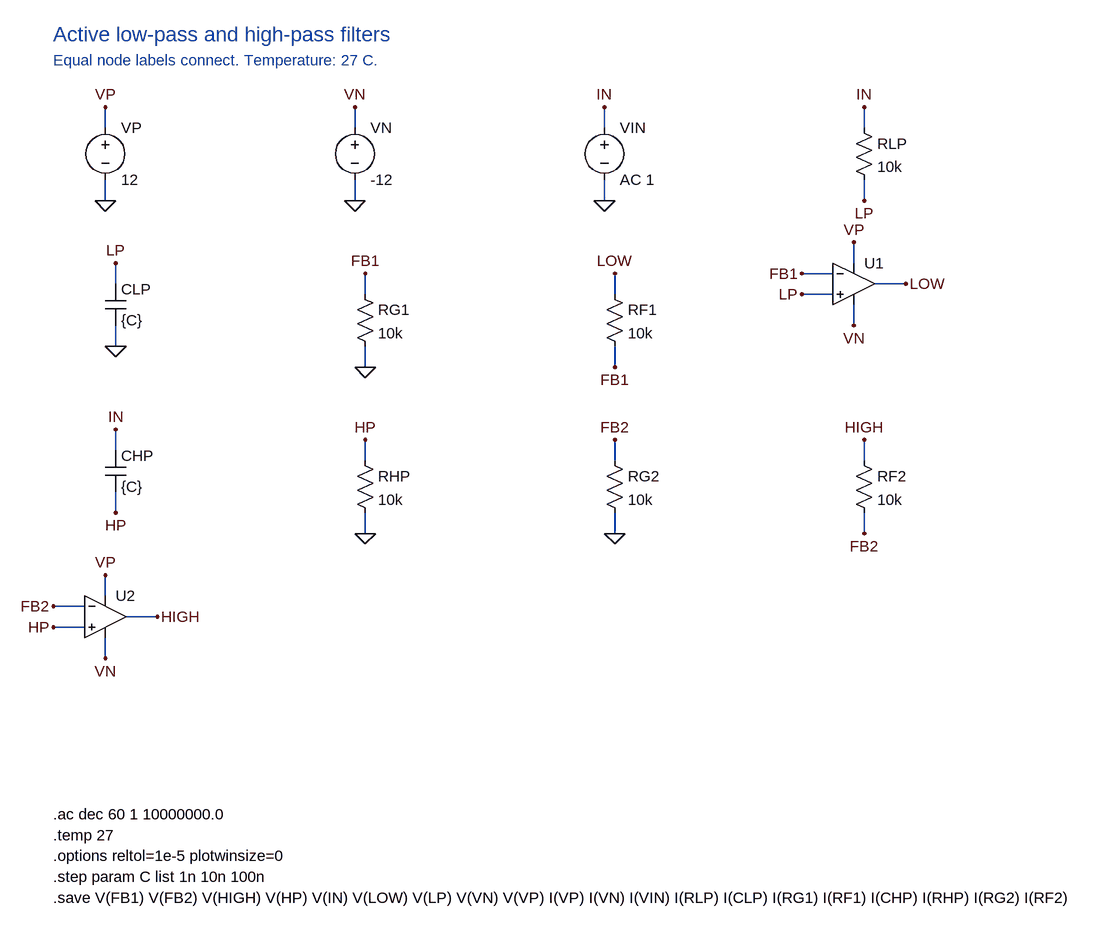
[diagram p0: schematic active-filter-pair.asc]
active-filter-pair.asc, the LTspice schematic file:
Version 4
SHEET 1 1740 1512
WIRE 144 176 144 144
WIRE 144 256 144 288
WIRE 528 176 528 144
WIRE 528 256 528 288
WIRE 912 176 912 144
WIRE 912 256 912 288
WIRE 1312 176 1312 144
WIRE 1312 256 1312 288
WIRE 160 416 160 384
WIRE 160 480 160 512
WIRE 544 432 544 400
WIRE 544 512 544 544
WIRE 928 432 928 400
WIRE 928 512 928 544
WIRE 1264 432 1216 432
WIRE 1264 400 1216 400
WIRE 1296 384 1296 352
WIRE 1296 448 1296 480
WIRE 1328 416 1376 416
WIRE 160 672 160 640
WIRE 160 736 160 768
WIRE 544 688 544 656
WIRE 544 768 544 800
WIRE 928 688 928 656
WIRE 928 768 928 800
WIRE 1312 688 1312 656
WIRE 1312 768 1312 800
WIRE 112 944 64 944
WIRE 112 912 64 912
WIRE 144 896 144 864
WIRE 144 960 144 992
WIRE 176 928 224 928
FLAG 144 144 VP
FLAG 144 288 0
FLAG 528 144 VN
FLAG 528 288 0
FLAG 912 144 IN
FLAG 912 288 0
FLAG 1312 144 IN
FLAG 1312 288 LP
FLAG 160 384 LP
FLAG 160 512 0
FLAG 544 400 FB1
FLAG 544 544 0
FLAG 928 400 LOW
FLAG 928 544 FB1
FLAG 1216 432 LP
FLAG 1216 400 FB1
FLAG 1296 352 VP
FLAG 1296 480 VN
FLAG 1376 416 LOW
FLAG 160 640 IN
FLAG 160 768 HP
FLAG 544 656 HP
FLAG 544 800 0
FLAG 928 656 FB2
FLAG 928 800 0
FLAG 1312 656 HIGH
FLAG 1312 800 FB2
FLAG 64 944 HP
FLAG 64 912 FB2
FLAG 144 864 VP
FLAG 144 992 VN
FLAG 224 928 HIGH
SYMBOL voltage 144 160 R0
SYMATTR InstName VP
SYMATTR Value 12
SYMBOL voltage 528 160 R0
SYMATTR InstName VN
SYMATTR Value -12
SYMBOL voltage 912 160 R0
SYMATTR InstName VIN
SYMATTR Value AC 1
SYMBOL res 1296 160 R0
SYMATTR InstName RLP
SYMATTR Value 10k
SYMBOL cap 144 416 R0
SYMATTR InstName CLP
SYMATTR Value {C}
SYMBOL res 528 416 R0
SYMATTR InstName RG1
SYMATTR Value 10k
SYMBOL res 912 416 R0
SYMATTR InstName RF1
SYMATTR Value 10k
SYMBOL OpAmps/UniversalOpamp2 1296 416 R0
SYMATTR InstName U1
SYMATTR SpiceModel level2
SYMATTR Value2 Avol=1Meg GBW=10Meg Slew=10Meg
SYMATTR SpiceLine Ilimit=100m Rail=0.5 Vos=0
SYMATTR SpiceLine2 En=0 Enk=0 In=0 Ink=0 Rin=1G
SYMBOL cap 144 672 R0
SYMATTR InstName CHP
SYMATTR Value {C}
SYMBOL res 528 672 R0
SYMATTR InstName RHP
SYMATTR Value 10k
SYMBOL res 912 672 R0
SYMATTR InstName RG2
SYMATTR Value 10k
SYMBOL res 1296 672 R0
SYMATTR InstName RF2
SYMATTR Value 10k
SYMBOL OpAmps/UniversalOpamp2 144 928 R0
SYMATTR InstName U2
SYMATTR SpiceModel level2
SYMATTR Value2 Avol=1Meg GBW=10Meg Slew=10Meg
SYMATTR SpiceLine Ilimit=100m Rail=0.5 Vos=0
SYMATTR SpiceLine2 En=0 Enk=0 In=0 Ink=0 Rin=1G
TEXT 64 32 Left 3 ;Active low-pass and high-pass filters
TEXT 64 72 Left 2 ;Equal node labels connect. Temperature: 27 C.
TEXT 64 1232 Left 2 !.ac dec 60 1 10000000.0
TEXT 64 1264 Left 2 !.temp 27
TEXT 64 1296 Left 2 !.options reltol=1e-5 plotwinsize=0
TEXT 64 1328 Left 2 !.step param C list 1n 10n 100n
TEXT 64 1360 Left 2 !.save V(FB1) V(FB2) V(HIGH) V(HP) V(IN) V(LOW) V(LP) V(VN) V(VP) I(VP) I(VN) I(VIN) I(RLP) I(CLP) I(RG1) I(RF1) I(CHP) I(RHP) I(RG2) I(RF2)

The netlist it stands for:
* active-filter-pair.asc
VP VP 0 12
VN VN 0 -12
VIN IN 0 AC 1
RLP IN LP 10k
CLP LP 0 {C}
RG1 FB1 0 10k
RF1 LOW FB1 10k
XU1 LP FB1 VP VN LOW level2 Avol=1Meg GBW=10Meg Slew=10Meg Ilimit=100m Rail=0.5 Vos=0 En=0 Enk=0 In=0 Ink=0 Rin=1G  ; pins In+ In- V+ V- OUT
CHP IN HP {C}
RHP HP 0 10k
RG2 FB2 0 10k
RF2 HIGH FB2 10k
XU2 HP FB2 VP VN HIGH level2 Avol=1Meg GBW=10Meg Slew=10Meg Ilimit=100m Rail=0.5 Vos=0 En=0 Enk=0 In=0 Ink=0 Rin=1G  ; pins In+ In- V+ V- OUT
* Active low-pass and high-pass filters
* Equal node labels connect. Temperature: 27 C.
.ac dec 60 1 10000000.0
.temp 27
.options reltol=1e-5 plotwinsize=0
.step param C list 1n 10n 100n
.save V(FB1) V(FB2) V(HIGH) V(HP) V(IN) V(LOW) V(LP) V(VN) V(VP) I(VP) I(VN) I(VIN) I(RLP) I(CLP) I(RG1) I(RF1) I(CHP) I(RHP) I(RG2) I(RF2)
.lib UniversalOpAmp2.lib
.backanno
.end